# EAGLE schematic Status_Board (EAGLE 8.5.2)
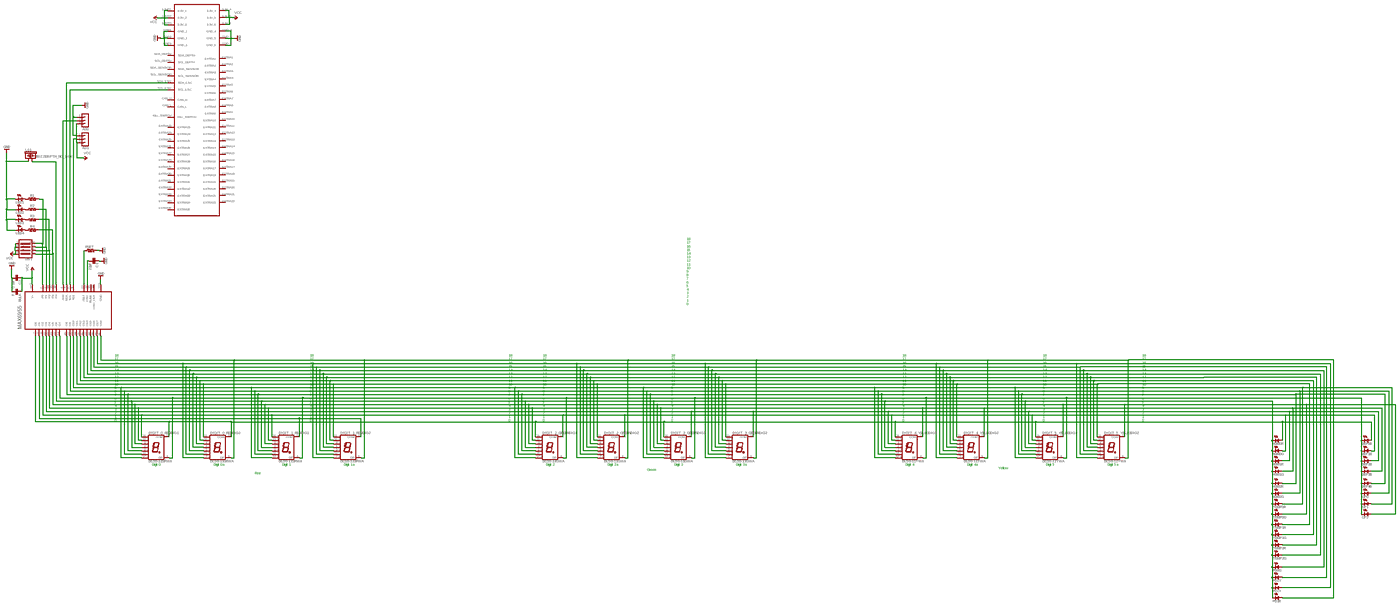
[diagram p0: schematic, sheet 1, overview]
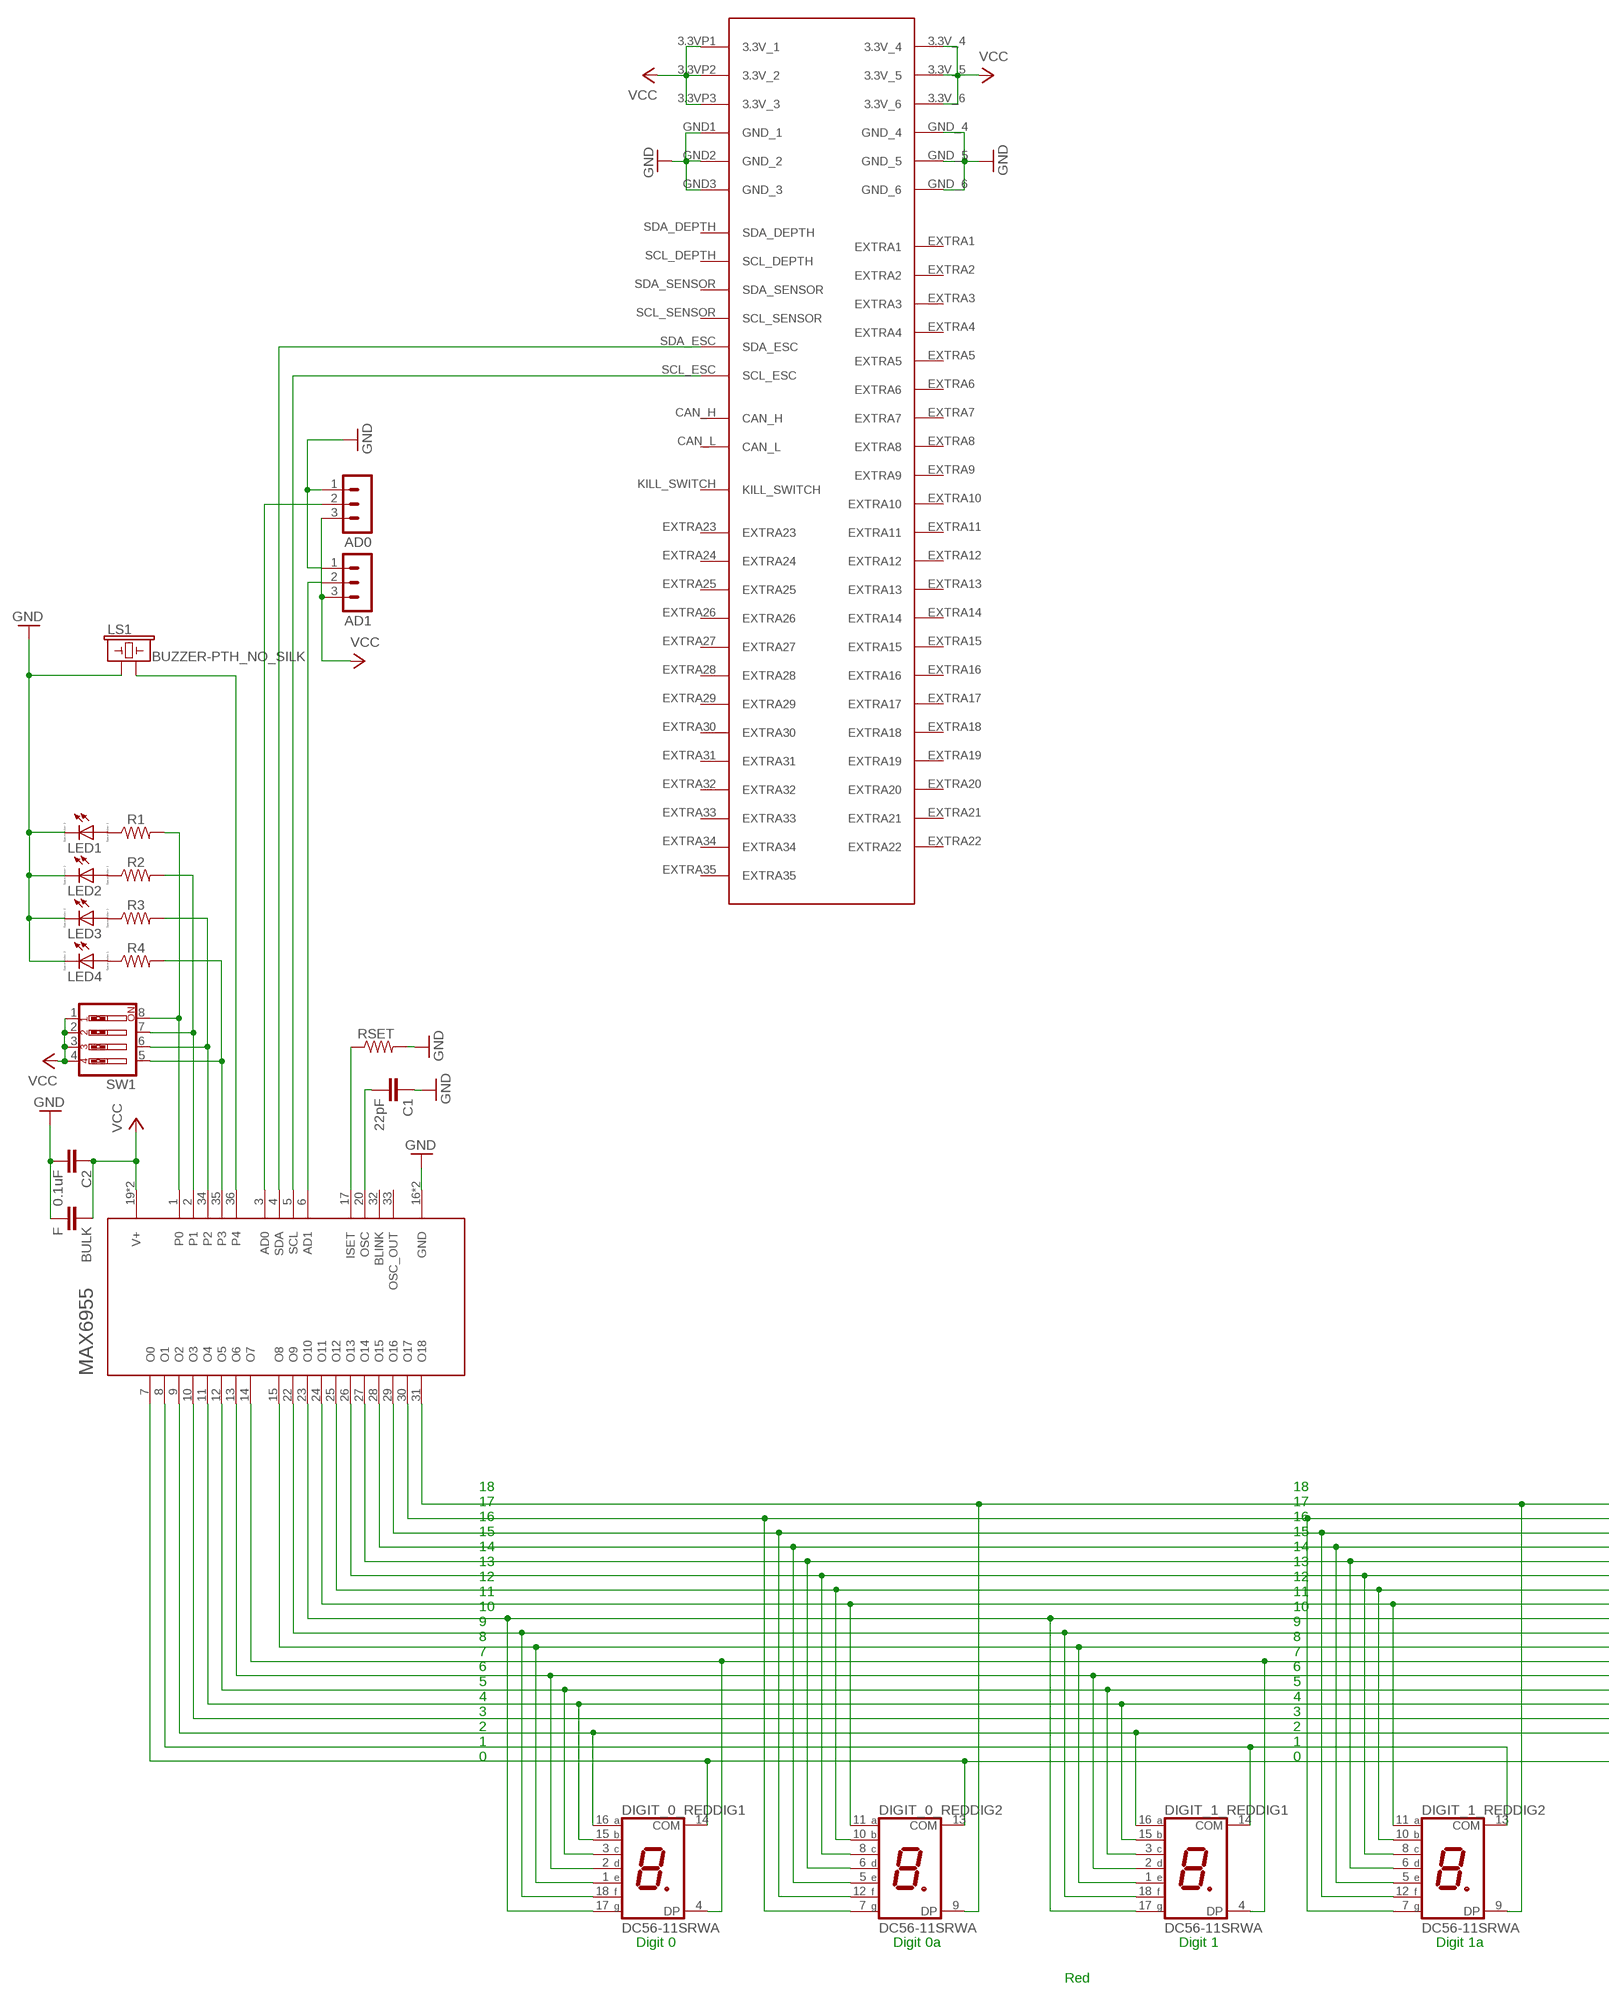
[diagram p1: schematic, sheet 1, part 1 of 4]
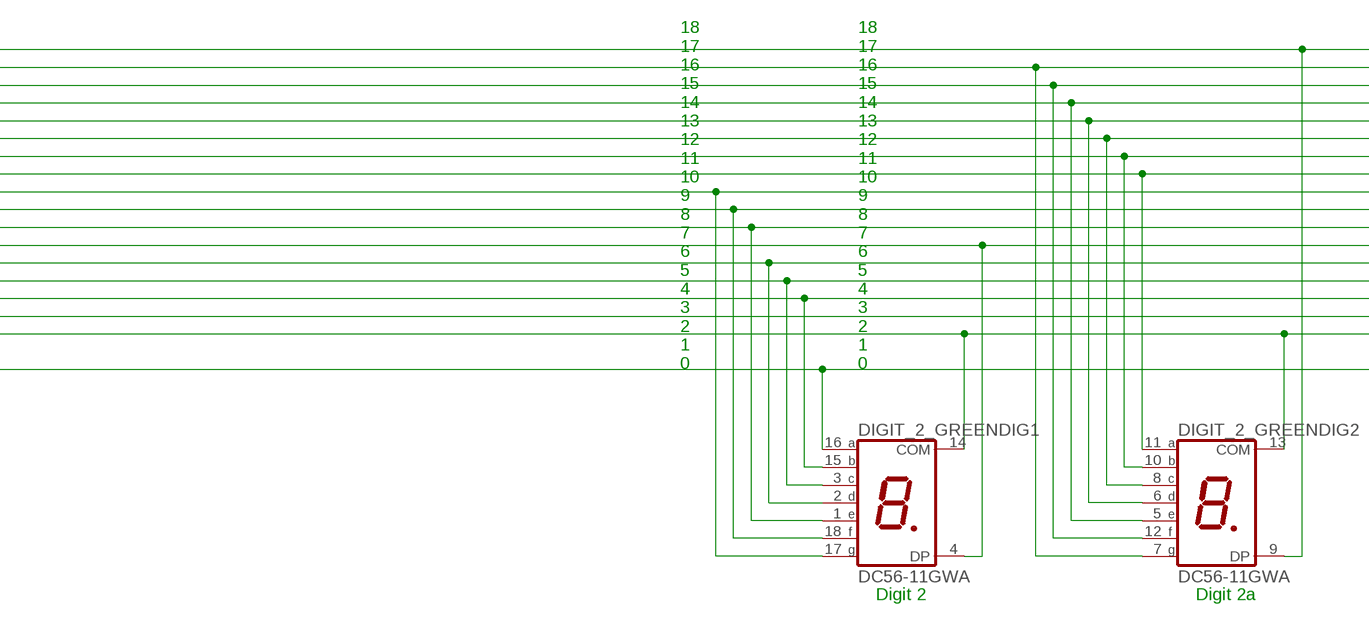
[diagram p2: schematic, sheet 1, part 2 of 4]
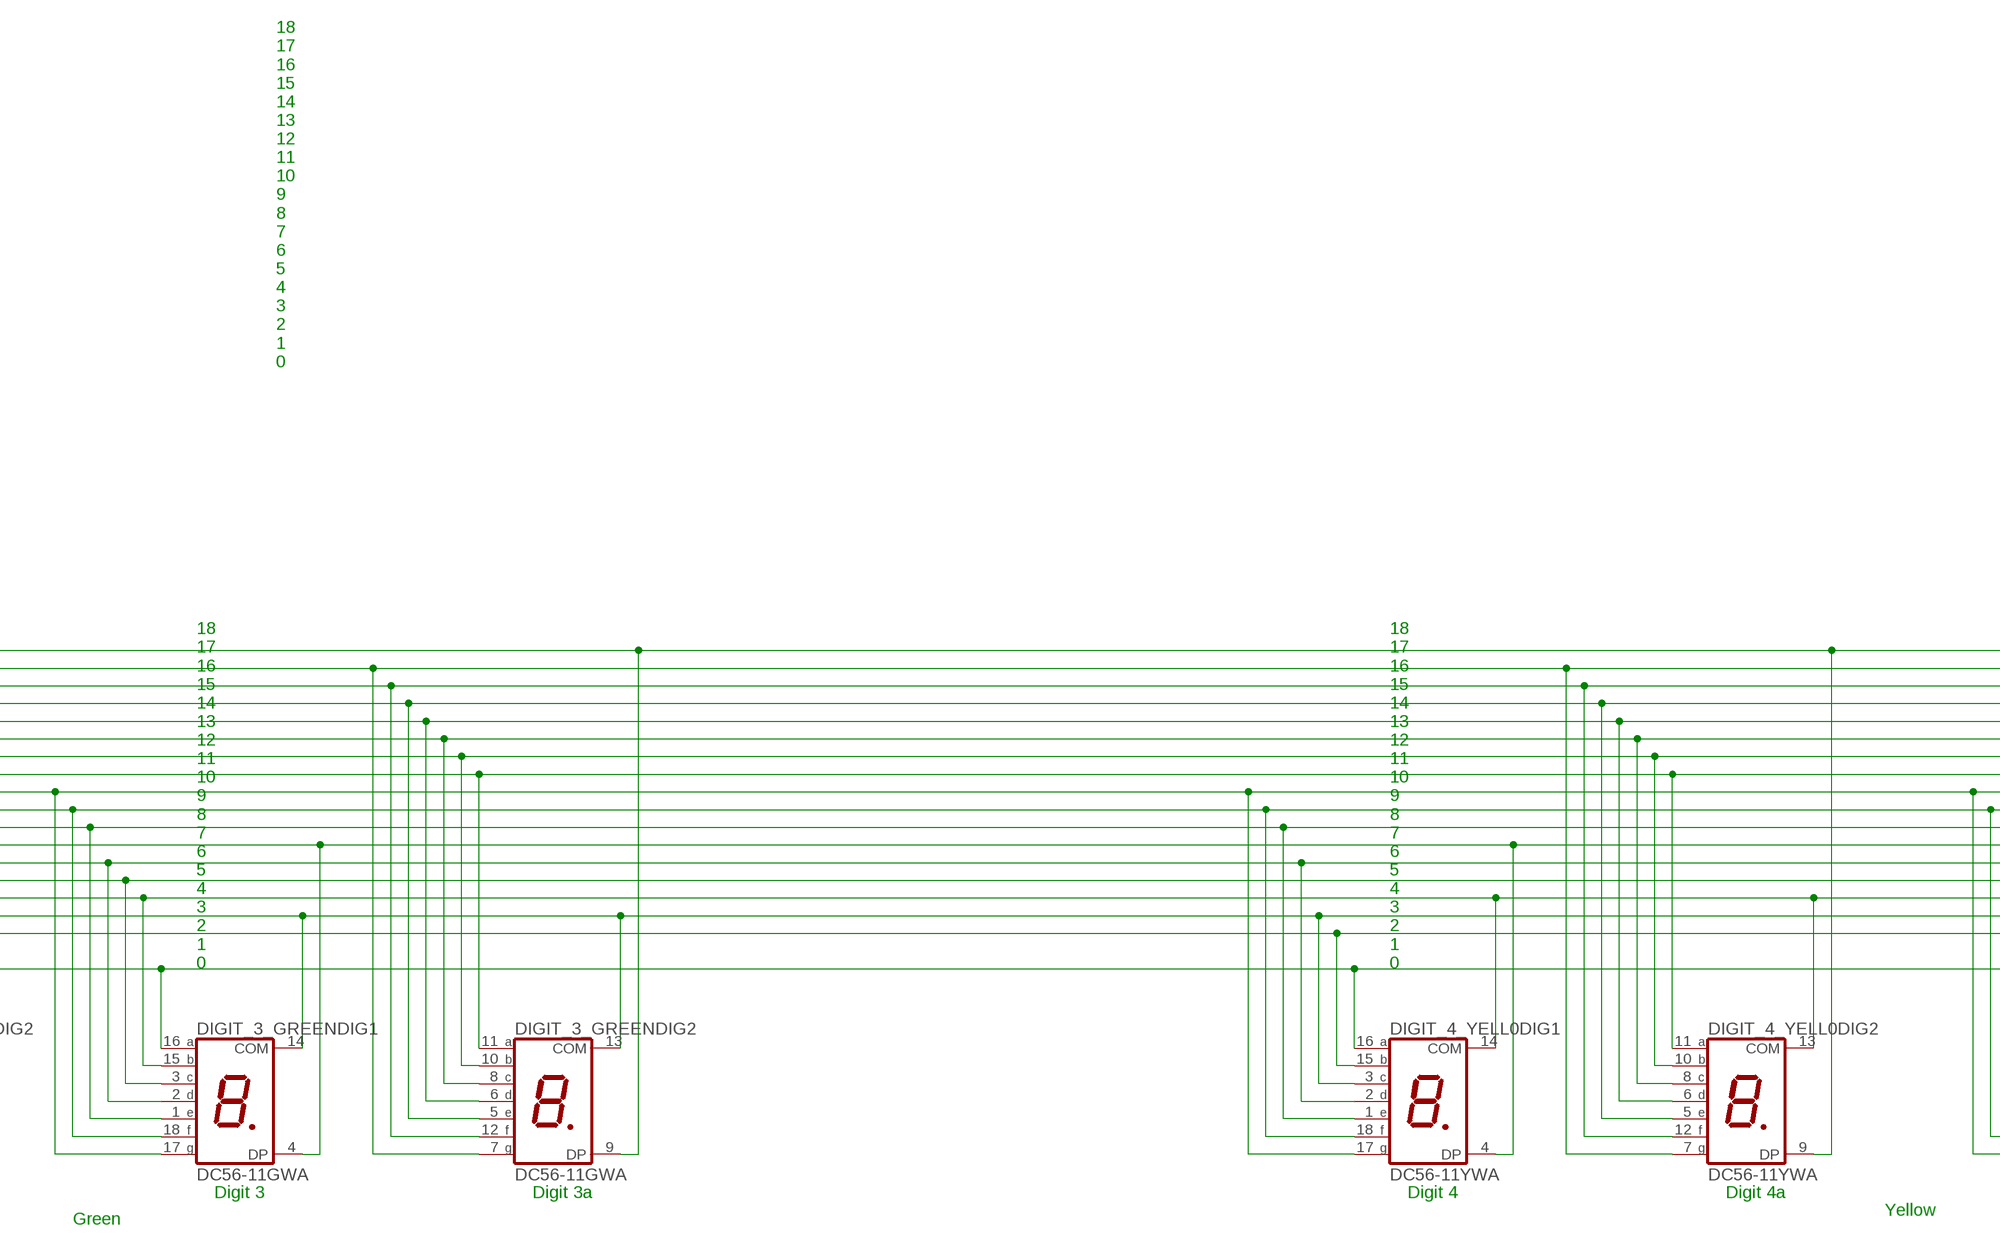
[diagram p3: schematic, sheet 1, part 3 of 4]
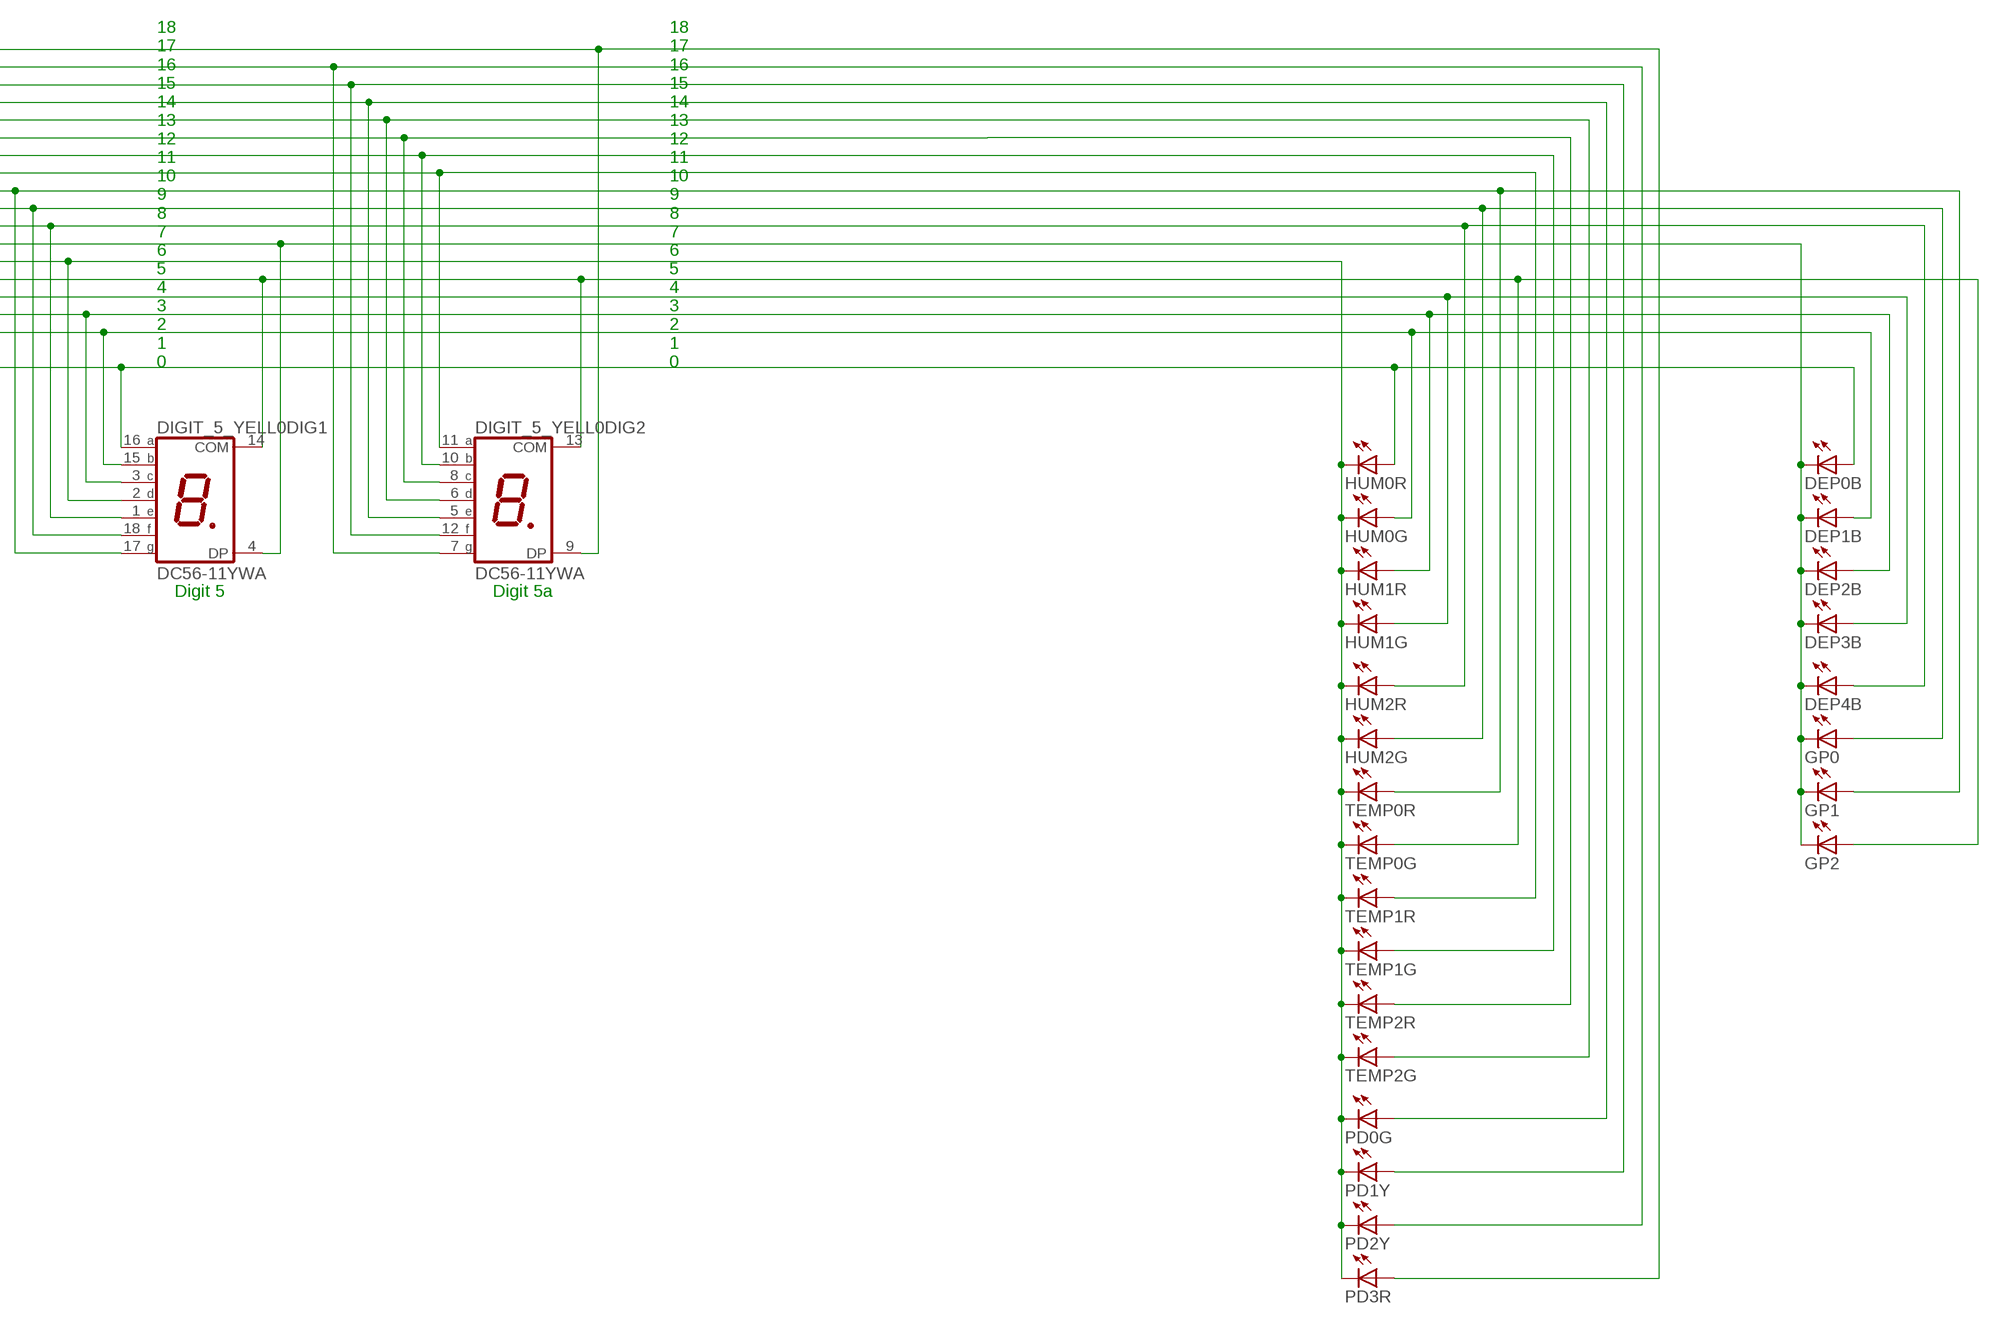
[diagram p4: schematic, sheet 1, part 4 of 4]

## Parts
AD0  MA03-1  [MA03-1]
AD1  MA03-1  [MA03-1]
BULK  F  0.1UF-KIT-EZ-50V-20%  [CAP-PTH-SMALL-KIT]
C1  22pF  22PF-PTH-2.54MM-200V-5%  [CAP-PTH-2.54]
C2  0.1uF  0.1UF-KIT-EZ-50V-20%  [CAP-PTH-SMALL-KIT]
DEP0B  LED3MM  [LED3MM]
DEP1B  LED3MM  [LED3MM]
DEP2B  LED3MM  [LED3MM]
DEP3B  LED3MM  [LED3MM]
DEP4B  LED3MM  [LED3MM]
DIGIT_0_RED  DC56-11SRWA  [DA56]
DIGIT_1_RED  DC56-11SRWA  [DA56]
DIGIT_2_GREEN  DC56-11GWA  [DA56]
DIGIT_3_GREEN  DC56-11GWA  [DA56]
DIGIT_4_YELL0  DC56-11YWA  [DA56]
DIGIT_5_YELL0  DC56-11YWA  [DA56]
GP0  LED3MM  [LED3MM]
GP1  LED3MM  [LED3MM]
GP2  LED3MM  [LED3MM]
HUM0G  LED3MM  [LED3MM]
HUM0R  LED3MM  [LED3MM]
HUM1G  LED3MM  [LED3MM]
HUM1R  LED3MM  [LED3MM]
HUM2G  LED3MM  [LED3MM]
HUM2R  LED3MM  [LED3MM]
LED1  LED_ESML0603  [LED_SML0603]
LED2  LED_ESML0603  [LED_SML0603]
LED3  LED_ESML0603  [LED_SML0603]
LED4  LED_ESML0603  [LED_SML0603]
LS1  BUZZER-PTH_NO_SILK  [BUZZER-12MM-NS]
MAX6955  MAX6955  [SSOP36]
PD0G  LED3MM  [LED3MM]
PD1Y  LED3MM  [LED3MM]
PD2Y  LED3MM  [LED3MM]
PD3R  LED3MM  [LED3MM]
R1  68OHM-0603-1/10W-1%  [0603]
R2  68OHM-0603-1/10W-1%  [0603]
R3  68OHM-0603-1/10W-1%  [0603]
R4  68OHM-0603-1/10W-1%  [0603]
RSET  R-US_0207/12  [0207/12]
SW1  SW_DIP-4  [EDG-04]
TEMP0G  LED3MM  [LED3MM]
TEMP0R  LED3MM  [LED3MM]
TEMP1G  LED3MM  [LED3MM]
TEMP1R  LED3MM  [LED3MM]
TEMP2G  LED3MM  [LED3MM]
TEMP2R  LED3MM  [LED3MM]
U$2  5530843  [5530843-6-BOARDFINGERS]

## Nets
013: DIGIT_0_RED.8(DIG2:C) DIGIT_1_RED.8(DIG2:C) DIGIT_2_GREEN.8(DIG2:C) DIGIT_3_GREEN.8(DIG2:C) DIGIT_4_YELL0.8(DIG2:C) DIGIT_5_YELL0.8(DIG2:C) MAX6955.26(O13) TEMP2R.A
AD0: AD0.2 MAX6955.3(AD0)
AD1: AD1.2 MAX6955.6(AD1)
GND: AD0.1 AD1.1 BULK.2 C1.1 C2.2 LED1.C LED2.C LED3.C LED4.C LS1.+ MAX6955.16(GND) MAX6955.18(GND) RSET.2 U$2.GND1(GND_1) U$2.GND2(GND_2) U$2.GND3(GND_3) U$2.GND_4 U$2.GND_5 U$2.GND_6
ISET: MAX6955.17(ISET) RSET.1
N$1: LED1.A R1.1
N$3: LED2.A R2.1
N$9: LED3.A R3.1
N$10: LED4.A R4.1
O0: DEP0B.A DIGIT_0_RED.13(DIG2:COM) DIGIT_0_RED.14(DIG1:COM) DIGIT_2_GREEN.16(DIG1:A) DIGIT_3_GREEN.16(DIG1:A) DIGIT_4_YELL0.16(DIG1:A) DIGIT_5_YELL0.16(DIG1:A) HUM0R.A MAX6955.7(O0)
O1: DIGIT_1_RED.13(DIG2:COM) DIGIT_1_RED.14(DIG1:COM) MAX6955.8(O1)
O2: DEP1B.A DIGIT_0_RED.16(DIG1:A) DIGIT_1_RED.16(DIG1:A) DIGIT_2_GREEN.13(DIG2:COM) DIGIT_2_GREEN.14(DIG1:COM) DIGIT_4_YELL0.15(DIG1:B) DIGIT_5_YELL0.15(DIG1:B) HUM0G.A MAX6955.9(O2)
O3: DEP2B.A DIGIT_3_GREEN.13(DIG2:COM) DIGIT_3_GREEN.14(DIG1:COM) DIGIT_4_YELL0.3(DIG1:C) DIGIT_5_YELL0.3(DIG1:C) HUM1R.A MAX6955.10(O3)
O4: DEP3B.A DIGIT_0_RED.15(DIG1:B) DIGIT_1_RED.15(DIG1:B) DIGIT_2_GREEN.15(DIG1:B) DIGIT_3_GREEN.15(DIG1:B) DIGIT_4_YELL0.13(DIG2:COM) DIGIT_4_YELL0.14(DIG1:COM) HUM1G.A MAX6955.11(O4)
O5: DIGIT_0_RED.3(DIG1:C) DIGIT_1_RED.3(DIG1:C) DIGIT_2_GREEN.3(DIG1:C) DIGIT_3_GREEN.3(DIG1:C) DIGIT_5_YELL0.13(DIG2:COM) DIGIT_5_YELL0.14(DIG1:COM) GP2.A MAX6955.12(O5) TEMP0G.A
O6: DIGIT_0_RED.2(DIG1:D) DIGIT_1_RED.2(DIG1:D) DIGIT_2_GREEN.2(DIG1:D) DIGIT_3_GREEN.2(DIG1:D) DIGIT_4_YELL0.2(DIG1:D) DIGIT_5_YELL0.2(DIG1:D) HUM0G.K(C) HUM0R.K(C) HUM1G.K(C) HUM1R.K(C) HUM2G.K(C) HUM2R.K(C) MAX6955.13(O6) PD0G.K(C) PD1Y.K(C) PD2Y.K(C) PD3R.K(C) TEMP0G.K(C) TEMP0R.K(C) TEMP1G.K(C) TEMP1R.K(C) TEMP2G.K(C) TEMP2R.K(C)
O7: DEP0B.K(C) DEP1B.K(C) DEP2B.K(C) DEP3B.K(C) DEP4B.K(C) DIGIT_0_RED.4(DIG1:DP) DIGIT_1_RED.4(DIG1:DP) DIGIT_2_GREEN.4(DIG1:DP) DIGIT_3_GREEN.4(DIG1:DP) DIGIT_4_YELL0.4(DIG1:DP) DIGIT_5_YELL0.4(DIG1:DP) GP0.K(C) GP1.K(C) GP2.K(C) MAX6955.14(O7)
O8: DEP4B.A DIGIT_0_RED.1(DIG1:E) DIGIT_1_RED.1(DIG1:E) DIGIT_2_GREEN.1(DIG1:E) DIGIT_3_GREEN.1(DIG1:E) DIGIT_4_YELL0.1(DIG1:E) DIGIT_5_YELL0.1(DIG1:E) HUM2R.A MAX6955.15(O8)
O9: DIGIT_0_RED.18(DIG1:F) DIGIT_1_RED.18(DIG1:F) DIGIT_2_GREEN.18(DIG1:F) DIGIT_3_GREEN.18(DIG1:F) DIGIT_4_YELL0.18(DIG1:F) DIGIT_5_YELL0.18(DIG1:F) GP0.A HUM2G.A MAX6955.22(O9)
O10: DIGIT_0_RED.17(DIG1:G) DIGIT_1_RED.17(DIG1:G) DIGIT_2_GREEN.17(DIG1:G) DIGIT_3_GREEN.17(DIG1:G) DIGIT_4_YELL0.17(DIG1:G) DIGIT_5_YELL0.17(DIG1:G) GP1.A MAX6955.23(O10) TEMP0R.A
O11: DIGIT_0_RED.11(DIG2:A) DIGIT_1_RED.11(DIG2:A) DIGIT_2_GREEN.11(DIG2:A) DIGIT_3_GREEN.11(DIG2:A) DIGIT_4_YELL0.11(DIG2:A) DIGIT_5_YELL0.11(DIG2:A) MAX6955.24(O11) TEMP1R.A
O12: DIGIT_0_RED.10(DIG2:B) DIGIT_1_RED.10(DIG2:B) DIGIT_2_GREEN.10(DIG2:B) DIGIT_3_GREEN.10(DIG2:B) DIGIT_4_YELL0.10(DIG2:B) DIGIT_5_YELL0.10(DIG2:B) MAX6955.25(O12) TEMP1G.A
O14: DIGIT_0_RED.6(DIG2:D) DIGIT_1_RED.6(DIG2:D) DIGIT_2_GREEN.6(DIG2:D) DIGIT_3_GREEN.6(DIG2:D) DIGIT_4_YELL0.6(DIG2:D) DIGIT_5_YELL0.6(DIG2:D) MAX6955.27(O14) TEMP2G.A
O15: DIGIT_0_RED.5(DIG2:E) DIGIT_1_RED.5(DIG2:E) DIGIT_2_GREEN.5(DIG2:E) DIGIT_3_GREEN.5(DIG2:E) DIGIT_4_YELL0.5(DIG2:E) DIGIT_5_YELL0.5(DIG2:E) MAX6955.28(O15) PD0G.A
O16: DIGIT_0_RED.12(DIG2:F) DIGIT_1_RED.12(DIG2:F) DIGIT_2_GREEN.12(DIG2:F) DIGIT_3_GREEN.12(DIG2:F) DIGIT_4_YELL0.12(DIG2:F) DIGIT_5_YELL0.12(DIG2:F) MAX6955.29(O16) PD1Y.A
O17: DIGIT_0_RED.7(DIG2:G) DIGIT_1_RED.7(DIG2:G) DIGIT_2_GREEN.7(DIG2:G) DIGIT_3_GREEN.7(DIG2:G) DIGIT_4_YELL0.7(DIG2:G) DIGIT_5_YELL0.7(DIG2:G) MAX6955.30(O17) PD2Y.A
O18: DIGIT_0_RED.9(DIG2:DP) DIGIT_1_RED.9(DIG2:DP) DIGIT_2_GREEN.9(DIG2:DP) DIGIT_3_GREEN.9(DIG2:DP) DIGIT_4_YELL0.9(DIG2:DP) DIGIT_5_YELL0.9(DIG2:DP) MAX6955.31(O18) PD3R.A
OSC: C1.2 MAX6955.20(OSC)
P0: MAX6955.1(P0) R1.2 SW1.8
P1: MAX6955.2(P1) R2.2 SW1.7
P2: MAX6955.34(P2) R3.2 SW1.6
P3: MAX6955.35(P3) R4.2 SW1.5
P4: LS1.- MAX6955.36(P4)
SCL: MAX6955.5(SCL) U$2.SCL_ESC
SDA: MAX6955.4(SDA) U$2.SDA_ESC
VCC: AD0.3 AD1.3 BULK.1 C2.1 MAX6955.19(V+) MAX6955.21(V+) SW1.1 SW1.2 SW1.3 SW1.4 U$2.3.3V_4 U$2.3.3V_5 U$2.3.3V_6 U$2.3.3VP1(3.3V_1) U$2.3.3VP2(3.3V_2) U$2.3.3VP3(3.3V_3)
Unconnected: MAX6955.32(BLINK) MAX6955.33(OSC_OUT) U$2.CAN_H U$2.CAN_L U$2.EXTRA1 U$2.EXTRA2 U$2.EXTRA3 U$2.EXTRA4 U$2.EXTRA5 U$2.EXTRA6 U$2.EXTRA7 U$2.EXTRA8 U$2.EXTRA9 U$2.EXTRA10 U$2.EXTRA11 U$2.EXTRA12 U$2.EXTRA13 U$2.EXTRA14 U$2.EXTRA15 U$2.EXTRA16 U$2.EXTRA17 U$2.EXTRA18 U$2.EXTRA19 U$2.EXTRA20 U$2.EXTRA21 U$2.EXTRA22 U$2.EXTRA23 U$2.EXTRA24 U$2.EXTRA25 U$2.EXTRA26 U$2.EXTRA27 U$2.EXTRA28 U$2.EXTRA29 U$2.EXTRA30 U$2.EXTRA31 U$2.EXTRA32 U$2.EXTRA33 U$2.EXTRA34 U$2.EXTRA35 U$2.KILL_SWITCH U$2.SCL_DEPTH U$2.SCL_SENSOR U$2.SDA_DEPTH U$2.SDA_SENSOR

## Notes on the sheet
- 18
  17
  16
  15
  14
  13
  12
  11
  10
  9
  8
  7
  6
  5
  4
  3
  2
  1
  0
- 18
  17
  16
  15
  14
  13
  12
  11
  10
  9
  8
  7
  6
  5
  4
  3
  2
  1
  0
- 18
  17
  16
  15
  14
  13
  12
  11
  10
  9
  8
  7
  6
  5
  4
  3
  2
  1
  0
- 18
  17
  16
  15
  14
  13
  12
  11
  10
  9
  8
  7
  6
  5
  4
  3
  2
  1
  0
- 18
  17
  16
  15
  14
  13
  12
  11
  10
  9
  8
  7
  6
  5
  4
  3
  2
  1
  0
- 18
  17
  16
  15
  14
  13
  12
  11
  10
  9
  8
  7
  6
  5
  4
  3
  2
  1
  0
- 18
  17
  16
  15
  14
  13
  12
  11
  10
  9
  8
  7
  6
  5
  4
  3
  2
  1
  0
- 18
  17
  16
  15
  14
  13
  12
  11
  10
  9
  8
  7
  6
  5
  4
  3
  2
  1
  0
- 18
  17
  16
  15
  14
  13
  12
  11
  10
  9
  8
  7
  6
  5
  4
  3
  2
  1
  0
- Digit 0 | Digit 0a | Digit 1 | Digit 1a | Digit 2 | Digit 2a | Digit 3 | Digit 3a | Digit 4 | Digit 4a | Digit 5 | Digit 5a
- Yellow
- Green
- Red

## Library data of the parts
AD0 AD1 = con-lstb:MA03-1: PIN HEADER; OC_FARNELL: unknown; OC_NEWARK: unknown
BULK = SparkFun-Capacitors:0.1UF: 0.1µF ceramic capacitors A capacitor is a passive two-terminal electrical component used to store electrical energy temporarily in an electric field.; PROD_ID: CAP-08370; VALUE: 0.1uF
C1 = SparkFun-Capacitors:22PF: 22pF ceramic capacitors A capacitor is a passive two-terminal electrical component used to store electrical energy temporarily in an electric field.; PROD_ID: CAP-09128
C2 = SparkFun-Capacitors:0.1UF: 0.1µF ceramic capacitors A capacitor is a passive two-terminal electrical component used to store electrical energy temporarily in an electric field.; PROD_ID: CAP-08370
DEP0B DEP1B DEP2B DEP3B DEP4B GP0 GP1 GP2 HUM0G HUM0R HUM1G HUM1R HUM2G HUM2R PD0G PD1Y PD2Y PD3R TEMP0G TEMP0R TEMP1G TEMP1R TEMP2G TEMP2R = led:LED: LED OSRAM: - CHIPLED LG R971, LG N971, LY N971, LG Q971, LY Q971, LO R971, LY R971 LH N974, LH R974 LS Q976, LO Q976, LY Q976 LO Q996 - Hyper CHIPLED LW Q18S LB Q993, LB Q99A, LB R99A - SideLED LS A670, LO A670, LY A670, LG A670, LP A670 LB A673, LV A673, LT A673, LW A673 LH A674 LY A675 LS A676, LA A676, LO A676, LY A676, LW A676 LS A679, LY A679, LG A679 - Hyper Micro SIDELED® LS Y876, LA Y876, LO Y876, LY Y876 LT Y87S - SmartLED LW L88C, LW L88S LB L89C, LB L89S, LG L890 LS L89K, LO L89K, LY L89K LS L896, LA L896, LO L896, LY L896 - TOPLED LS T670, LO T670, LY T670, LG T670, LP T670 LSG T670, LSP T670, LSY T670, LOP T670, LYG T670 LG T671, LOG T671, LSG T671 LB T673, LV T673, LT T673, LW T673 LH T674 LS T676, LA T676, LO T676, LY T676, LB T676, LH T676, LSB T676, LW T676 LB T67C, LV T67C, LT T67C, LS T67K, LO T67K, LY T67K, LW E67C LS E67B, LA E67B, LO E67B, LY E67B, LB E67C, LV E67C, LT E67C LW T67C LS T679, LY T679, LG T679 LS T770, LO T770, LY T770, LG T770, LP T770 LB T773, LV T773, LT T773, LW T773 LH T774 LS E675, LA E675, LY E675, LS T675 LS T776, LA T776, LO T776, LY T776, LB T776 LHGB T686 LT T68C, LB T68C - Hyper Mini TOPLED® LB M676 - Mini TOPLED Santana® LG M470 LS M47K, LO M47K, LY M47K Source: http://www.osram.convergy.de LUXEON: - LUMILED® LXK2-PW12-R00, LXK2-PW12-S00, LXK2-PW14-U00, LXK2-PW14-V00 LXK2-PM12-R00, LXK2-PM12-S00, LXK2-PM14-U00 LXK2-PE12-Q00, LXK2-PE12-R00, LXK2-PE12-S00, LXK2-PE14-T00, LXK2-PE14-U00 LXK2-PB12-K00, LXK2-PB12-L00, LXK2-PB12-M00, LXK2-PB14-N00, LXK2-PB14-P00, LXK2-PB14-Q00 LXK2-PR12-L00, LXK2-PR12-M00, LXK2-PR14-Q00, LXK2-PR14-R00 LXK2-PD12-Q00, LXK2-PD12-R00, LXK2-PD12-S00 LXK2-PH12-R00, LXK2-PH12-S00 LXK2-PL12-P00, LXK2-PL12-Q00, LXK2-PL12-R00 Source: www.luxeon.com KINGBRIGHT: KA-3528ASYC Source: www.kingbright.com
DIGIT_0_RED DIGIT_1_RED DIGIT_2_GREEN DIGIT_3_GREEN DIGIT_4_YELL0 DIGIT_5_YELL0 = display-kingbright:DC56-11: 14.22mm (0.56INCH) DUAL DIGIT NUMERIC DISPLAYS Source: www.kingbright.com .. DA56-11SRWA.pdf; OC_FARNELL: unknown; OC_NEWARK: unknown
LED1-LED4 = eagle-ltspice:LED_E: LED Source: http://www.osram.convergy.de Source: www.luxeon.com Source: www.kingbright.com; SPICEMODEL: NONE; SPICEPREFIX: D; SPICETYPE: diode
LS1 = Buzzer-AI-1223-TWT-3V-2-R:BUZZER: Buzzer Small round buzzers that operate around the audible 2kHz range. You can use these as speakers to create simple music or user interfaces. Variant Overview: PTH - Mini Speaker - PC Mount 12mm 2.048kHz <https://www.sparkfun.com/products/7950> PTH_KIT - Mini Speaker - PC Mount 12mm 2.048kHz <https://www.sparkfun.com/products/7950> KIT simplifies soldering by adding stop mask to one side of the pads. PTH_NO_SILK - Mini Speaker - PC Mount 12mm 2.048kHz <https://www.sparkfun.com/products/7950> No silkscreen indicator of buzzer outline. PTH_KIT_NO_SILK - Mini Speaker - PC Mount 12mm 2.048kHz <https://www.sparkfun.com/products/7950> KIT package w/o silkscreen SMD - Buzzer Audio Magnetic (CCV-084B16) SMD buzzer used on, e.g. the LilyPad Buzzer <https://www.sparkfun.com/products/8463> and RFID USB Reader <https://www.sparkfun.com/products/9963>. SMD_KIT - Buzzer Audio Magnetic (CCV-084B16) SMD Buzzer with elongated pins to make soldering easier. Used on the SparkFun Simon Says - Surface Mount Soldering Kit <https://www.sparkfun.com/products/10935>.; PROD_ID: COMP-08253; SF_SKU: COM-07950
MAX6955 = MAX6955:MAX6955
R1-R4 = SparkFun-Resistors:68OHM: 68Ω resistor A resistor is a passive two-terminal electrical component that implements electrical resistance as a circuit element. Resistors act to reduce current flow, and, at the same time, act to lower voltage levels within circuits. - Wikipedia
RSET = resistor:R-US_: RESISTOR, American symbol
SW1 = special:SW_DIP-4: DIP SWITCH
U$2 = 5530843-6:5530843